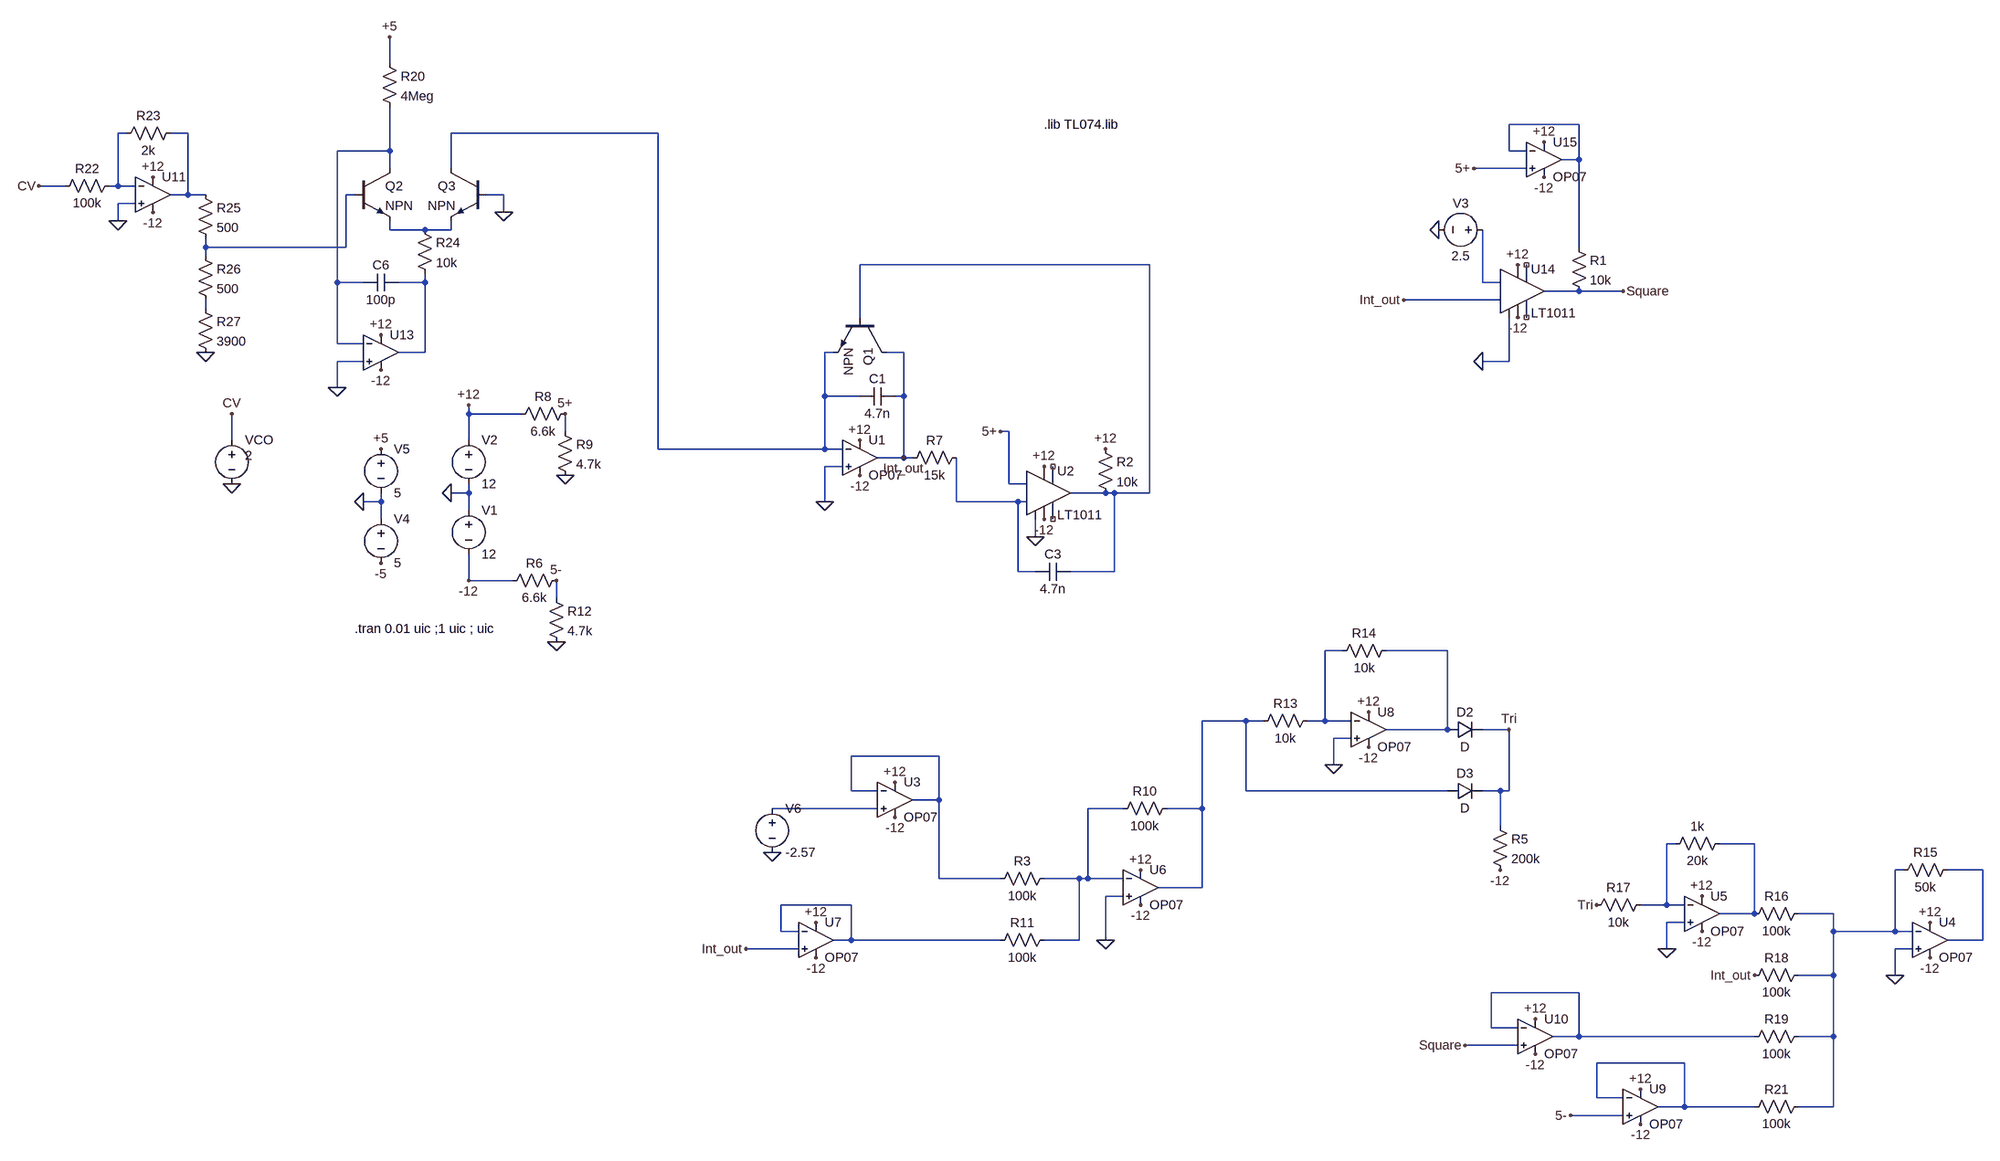
[diagram p0: schematic VCO new.asc]
VCO new.asc, the LTspice schematic file:
Version 4.1
SHEET 1 2884 1308
WIRE -816 -736 -816 -784
WIRE 1392 -624 1264 -624
WIRE -1296 -608 -1312 -608
WIRE -1184 -608 -1216 -608
WIRE -288 -608 -704 -608
WIRE -816 -576 -816 -656
WIRE -816 -576 -912 -576
WIRE 1264 -576 1264 -624
WIRE 1296 -576 1264 -576
WIRE 1392 -560 1392 -624
WIRE 1392 -560 1360 -560
WIRE -816 -544 -816 -576
WIRE -704 -544 -704 -608
WIRE 1296 -544 1200 -544
WIRE -1408 -512 -1456 -512
WIRE -1312 -512 -1312 -608
WIRE -1312 -512 -1328 -512
WIRE -1280 -512 -1312 -512
WIRE -1184 -496 -1184 -608
WIRE -1184 -496 -1216 -496
WIRE -1152 -496 -1184 -496
WIRE -880 -496 -896 -496
WIRE -608 -496 -640 -496
WIRE -1280 -480 -1312 -480
WIRE -608 -464 -608 -496
WIRE -1312 -448 -1312 -480
WIRE -816 -432 -816 -448
WIRE -752 -432 -816 -432
WIRE -704 -432 -704 -448
WIRE -704 -432 -752 -432
WIRE -1152 -400 -1152 -416
WIRE -896 -400 -896 -496
WIRE -896 -400 -1152 -400
WIRE 1392 -400 1392 -560
WIRE -1152 -384 -1152 -400
WIRE 608 -368 80 -368
WIRE -912 -336 -912 -576
WIRE -864 -336 -912 -336
WIRE -752 -336 -752 -352
WIRE -752 -336 -800 -336
WIRE 1216 -336 1216 -432
WIRE 1248 -336 1216 -336
WIRE 1392 -320 1328 -320
WIRE 1472 -320 1392 -320
WIRE 1248 -304 1072 -304
WIRE -1152 -288 -1152 -304
WIRE 80 -272 80 -368
WIRE -912 -224 -912 -336
WIRE -864 -224 -912 -224
WIRE -752 -208 -752 -336
WIRE -752 -208 -800 -208
WIRE 32 -208 16 -208
WIRE 160 -208 128 -208
WIRE -864 -192 -912 -192
WIRE 1264 -192 1264 -272
WIRE 1264 -192 1216 -192
WIRE -912 -144 -912 -192
WIRE 16 -128 16 -208
WIRE 80 -128 16 -128
WIRE 160 -128 160 -208
WIRE 160 -128 144 -128
WIRE -672 -96 -672 -112
WIRE -576 -96 -672 -96
WIRE -496 -64 -496 -96
WIRE 352 -64 336 -64
WIRE -1104 -48 -1104 -96
WIRE -672 -48 -672 -96
WIRE -288 -32 -288 -608
WIRE 16 -32 16 -128
WIRE 16 -32 -288 -32
WIRE 48 -32 16 -32
WIRE 160 -16 160 -128
WIRE 160 -16 112 -16
WIRE 176 -16 160 -16
WIRE 48 0 16 0
WIRE 352 32 352 -64
WIRE 384 32 352 32
WIRE -672 48 -672 32
WIRE -672 48 -704 48
WIRE 528 48 464 48
WIRE 544 48 528 48
WIRE 608 48 608 -368
WIRE 608 48 544 48
WIRE -832 64 -832 48
WIRE -832 64 -864 64
WIRE 16 64 16 0
WIRE 256 64 256 -16
WIRE 368 64 256 64
WIRE 384 64 368 64
WIRE -672 80 -672 48
WIRE -832 96 -832 64
WIRE 400 128 400 96
WIRE 368 192 368 64
WIRE 400 192 368 192
WIRE 544 192 544 48
WIRE 544 192 464 192
WIRE -672 208 -672 160
WIRE -592 208 -672 208
WIRE -512 240 -512 208
WIRE 960 336 928 336
WIRE 1152 336 1040 336
WIRE 784 464 704 464
WIRE 816 464 784 464
WIRE 928 464 928 336
WIRE 928 464 896 464
WIRE 976 464 928 464
WIRE 1152 480 1152 336
WIRE 1152 480 1040 480
WIRE 1264 480 1216 480
WIRE 976 496 944 496
WIRE 224 528 64 528
WIRE 944 544 944 496
WIRE 64 592 64 528
WIRE 112 592 64 592
WIRE 784 592 784 464
WIRE 1152 592 784 592
WIRE 1248 592 1216 592
WIRE 1264 592 1264 480
WIRE 1264 592 1248 592
WIRE 224 608 224 528
WIRE 224 608 176 608
WIRE 112 624 -80 624
WIRE 560 624 496 624
WIRE 704 624 704 464
WIRE 704 624 640 624
WIRE 1248 656 1248 592
WIRE 1568 688 1552 688
WIRE 1712 688 1648 688
WIRE 1984 736 1968 736
WIRE 2128 736 2064 736
WIRE 224 752 224 608
WIRE 336 752 224 752
WIRE 480 752 416 752
WIRE 496 752 496 624
WIRE 496 752 480 752
WIRE 560 752 496 752
WIRE 704 768 704 624
WIRE 704 768 624 768
WIRE 560 784 528 784
WIRE 64 800 -64 800
WIRE 1552 800 1552 688
WIRE 1552 800 1504 800
WIRE 1584 800 1552 800
WIRE 1712 816 1712 688
WIRE 1712 816 1648 816
WIRE 1856 816 1792 816
WIRE 1584 832 1552 832
WIRE -64 848 -64 800
WIRE -32 848 -64 848
WIRE 1856 848 1856 816
WIRE 1968 848 1968 736
WIRE 1968 848 1856 848
WIRE 2000 848 1968 848
WIRE 64 864 64 800
WIRE 64 864 32 864
WIRE 336 864 64 864
WIRE 480 864 480 752
WIRE 480 864 416 864
WIRE 528 864 528 784
WIRE 2128 864 2128 736
WIRE 2128 864 2064 864
WIRE -32 880 -128 880
WIRE 1552 880 1552 832
WIRE 2000 880 1968 880
WIRE 1856 928 1856 848
WIRE 1856 928 1792 928
WIRE 1968 928 1968 880
WIRE 1392 960 1232 960
WIRE 1232 1024 1232 960
WIRE 1280 1024 1232 1024
WIRE 1392 1040 1392 960
WIRE 1392 1040 1344 1040
WIRE 1712 1040 1392 1040
WIRE 1856 1040 1856 928
WIRE 1856 1040 1792 1040
WIRE 1280 1056 1184 1056
WIRE 1584 1088 1424 1088
WIRE 1424 1152 1424 1088
WIRE 1472 1152 1424 1152
WIRE 1584 1168 1584 1088
WIRE 1584 1168 1536 1168
WIRE 1712 1168 1584 1168
WIRE 1856 1168 1856 1040
WIRE 1856 1168 1792 1168
WIRE 1472 1184 1376 1184
FLAG -704 48 0
FLAG -672 208 -12
FLAG 416 96 -12
FLAG 416 0 +12
FLAG 400 128 0
FLAG -864 64 0
FLAG -832 -32 +5
FLAG -832 176 -5
FLAG 528 -32 +12
FLAG 16 64 0
FLAG 80 -48 +12
FLAG 80 16 -12
FLAG 160 -16 Int_out
FLAG -672 -112 +12
FLAG -496 16 0
FLAG -496 -96 5+
FLAG 336 -64 5+
FLAG -512 320 0
FLAG -512 208 5-
FLAG 1008 448 +12
FLAG 1008 512 -12
FLAG 944 544 0
FLAG -608 -464 0
FLAG -1248 -528 +12
FLAG -1248 -464 -12
FLAG -1312 -448 0
FLAG -1104 32 0
FLAG -1104 -96 CV
FLAG -1456 -512 CV
FLAG -1152 -208 0
FLAG -832 -240 +12
FLAG -832 -176 -12
FLAG -912 -144 0
FLAG -816 -784 +5
FLAG 1280 -272 -12
FLAG 1280 -368 +12
FLAG 1472 -320 Square
FLAG 1216 -192 0
FLAG 1200 -544 5+
FLAG 1328 -592 +12
FLAG 1328 -528 -12
FLAG 1136 -432 0
FLAG 144 640 -12
FLAG 144 576 +12
FLAG 592 736 +12
FLAG 592 800 -12
FLAG 0 832 +12
FLAG 0 896 -12
FLAG -128 880 Int_out
FLAG 528 864 0
FLAG -80 704 0
FLAG 1072 -304 Int_out
FLAG 1248 736 -12
FLAG 1264 480 Tri
FLAG 2032 832 +12
FLAG 2032 896 -12
FLAG 1968 928 0
FLAG 1424 800 Tri
FLAG 1616 784 +12
FLAG 1616 848 -12
FLAG 1552 880 0
FLAG 1712 928 Int_out
FLAG 1504 1200 -12
FLAG 1504 1136 +12
FLAG 1376 1184 5-
FLAG 1312 1072 -12
FLAG 1312 1008 +12
FLAG 1184 1056 Square
SYMBOL voltage -672 64 R0
WINDOW 123 0 0 Left 0
WINDOW 39 0 0 Left 0
SYMATTR InstName V1
SYMATTR Value 12
SYMBOL voltage -672 -64 R0
WINDOW 123 0 0 Left 0
WINDOW 39 0 0 Left 0
SYMATTR InstName V2
SYMATTR Value 12
SYMBOL Comparators\\LT1011 416 48 R0
SYMATTR InstName U2
SYMBOL voltage -832 80 R0
WINDOW 123 0 0 Left 0
WINDOW 39 0 0 Left 0
SYMATTR InstName V4
SYMATTR Value 5
SYMBOL voltage -832 -48 R0
WINDOW 123 0 0 Left 0
WINDOW 39 0 0 Left 0
SYMATTR InstName V5
SYMATTR Value 5
SYMBOL res 512 -48 R0
SYMATTR InstName R2
SYMATTR Value 10k
SYMBOL OpAmps\\OP07 80 -80 R0
SYMATTR InstName U1
SYMBOL cap 144 -144 R90
WINDOW 0 0 32 VBottom 2
WINDOW 3 32 32 VTop 2
SYMATTR InstName C1
SYMATTR Value 4.7n
SYMBOL npn 128 -272 R90
SYMATTR InstName Q1
SYMBOL res -592 -80 R270
WINDOW 0 32 56 VTop 2
WINDOW 3 0 56 VBottom 2
SYMATTR InstName R8
SYMATTR Value 6.6k
SYMBOL res -512 -80 R0
SYMATTR InstName R9
SYMATTR Value 4.7k
SYMBOL res -608 224 R270
WINDOW 0 32 56 VTop 2
WINDOW 3 0 56 VBottom 2
SYMATTR InstName R6
SYMATTR Value 6.6k
SYMBOL res -528 224 R0
SYMATTR InstName R12
SYMATTR Value 4.7k
SYMBOL OpAmps\\OP07 1008 416 R0
SYMATTR InstName U8
SYMBOL res 912 448 R90
WINDOW 0 0 56 VBottom 2
WINDOW 3 32 56 VTop 2
SYMATTR InstName R13
SYMATTR Value 10k
SYMBOL res 1056 320 R90
WINDOW 0 0 56 VBottom 2
WINDOW 3 32 56 VTop 2
SYMATTR InstName R14
SYMATTR Value 10k
SYMBOL diode 1152 496 R270
WINDOW 0 32 32 VTop 2
WINDOW 3 0 32 VBottom 2
SYMATTR InstName D2
SYMBOL diode 1152 608 R270
WINDOW 0 32 32 VTop 2
WINDOW 3 0 32 VBottom 2
SYMATTR InstName D3
SYMBOL npn -880 -544 R0
SYMATTR InstName Q2
SYMBOL npn -640 -544 M0
SYMATTR InstName Q3
SYMBOL OpAmps\\UniversalOpAmp -1248 -496 R0
SYMATTR InstName U11
SYMBOL res -1312 -528 R90
WINDOW 0 0 56 VBottom 2
WINDOW 3 32 56 VTop 2
SYMATTR InstName R22
SYMATTR Value 100k
SYMBOL voltage -1104 -64 R0
WINDOW 123 0 0 Left 0
WINDOW 39 0 0 Left 0
WINDOW 3 24 44 Left 2
SYMATTR Value 2
SYMATTR InstName VCO
SYMBOL res -1200 -624 R90
WINDOW 0 0 56 VBottom 2
WINDOW 3 32 56 VTop 2
SYMATTR InstName R23
SYMATTR Value 2k
SYMBOL res -768 -448 R0
SYMATTR InstName R24
SYMATTR Value 10k
SYMBOL res -1168 -512 R0
SYMATTR InstName R25
SYMATTR Value 500
SYMBOL res -1168 -400 R0
SYMATTR InstName R26
SYMATTR Value 500
SYMBOL res -1168 -304 R0
SYMATTR InstName R27
SYMATTR Value 3900
SYMBOL OpAmps\\UniversalOpAmp -832 -208 R0
SYMATTR InstName U13
SYMBOL cap -800 -352 R90
WINDOW 0 0 32 VBottom 2
WINDOW 3 32 32 VTop 2
SYMATTR InstName C6
SYMATTR Value 100p
SYMBOL res -832 -752 R0
SYMATTR InstName R20
SYMATTR Value 4Meg
SYMBOL Comparators\\LT1011 1280 -320 R0
SYMATTR InstName U14
SYMBOL res 1376 -416 R0
SYMATTR InstName R1
SYMATTR Value 10k
SYMBOL OpAmps\\OP07 1328 -624 R0
SYMATTR InstName U15
SYMBOL voltage 1232 -432 R90
WINDOW 0 -32 56 VBottom 2
WINDOW 3 32 56 VTop 2
WINDOW 123 0 0 Left 0
WINDOW 39 0 0 Left 0
SYMATTR InstName V3
SYMATTR Value 2.5
SYMBOL OpAmps\\OP07 144 544 R0
SYMATTR InstName U3
SYMBOL OpAmps\\OP07 592 704 R0
SYMATTR InstName U6
SYMBOL res 432 736 R90
WINDOW 0 0 56 VBottom 2
WINDOW 3 32 56 VTop 2
SYMATTR InstName R3
SYMATTR Value 100k
SYMBOL res 656 608 R90
WINDOW 0 0 56 VBottom 2
WINDOW 3 32 56 VTop 2
SYMATTR InstName R10
SYMATTR Value 100k
SYMBOL OpAmps\\OP07 0 800 R0
SYMATTR InstName U7
SYMBOL res 432 848 R90
WINDOW 0 0 56 VBottom 2
WINDOW 3 32 56 VTop 2
SYMATTR InstName R11
SYMATTR Value 100k
SYMBOL voltage -80 608 R0
WINDOW 123 0 0 Left 0
WINDOW 39 0 0 Left 0
SYMATTR InstName V6
SYMATTR Value -2.57
SYMBOL res 1232 640 R0
SYMATTR InstName R5
SYMATTR Value 200k
SYMBOL res 272 -32 R90
WINDOW 0 0 56 VBottom 2
WINDOW 3 32 56 VTop 2
SYMATTR InstName R7
SYMATTR Value 15k
SYMBOL cap 464 176 R90
WINDOW 0 0 32 VBottom 2
WINDOW 3 32 32 VTop 2
SYMATTR InstName C3
SYMATTR Value 4.7n
SYMBOL OpAmps\\OP07 2032 800 R0
SYMATTR InstName U4
SYMBOL res 2080 720 R90
WINDOW 0 0 56 VBottom 2
WINDOW 3 32 56 VTop 2
SYMATTR InstName R15
SYMATTR Value 50k
SYMBOL OpAmps\\OP07 1616 752 R0
SYMATTR InstName U5
SYMBOL res 1664 672 R90
WINDOW 0 0 56 VBottom 2
WINDOW 3 32 56 VTop 2
SYMATTR InstName 1k
SYMATTR Value 20k
SYMBOL res 1520 784 R90
WINDOW 0 0 56 VBottom 2
WINDOW 3 32 56 VTop 2
SYMATTR InstName R17
SYMATTR Value 10k
SYMBOL res 1808 800 R90
WINDOW 0 0 56 VBottom 2
WINDOW 3 32 56 VTop 2
SYMATTR InstName R16
SYMATTR Value 100k
SYMBOL res 1808 912 R90
WINDOW 0 0 56 VBottom 2
WINDOW 3 32 56 VTop 2
SYMATTR InstName R18
SYMATTR Value 100k
SYMBOL res 1808 1024 R90
WINDOW 0 0 56 VBottom 2
WINDOW 3 32 56 VTop 2
SYMATTR InstName R19
SYMATTR Value 100k
SYMBOL res 1808 1152 R90
WINDOW 0 0 56 VBottom 2
WINDOW 3 32 56 VTop 2
SYMATTR InstName R21
SYMATTR Value 100k
SYMBOL OpAmps\\OP07 1504 1104 R0
SYMATTR InstName U9
SYMBOL OpAmps\\OP07 1312 976 R0
SYMATTR InstName U10
TEXT -880 296 Left 2 !.tran 0.01 uic ;1 uic ; uic
TEXT 416 -624 Left 2 !.lib TL074.lib

The netlist it stands for:
* VCO new.asc
V1 0 -12 12
V2 +12 0 12
X§U2 0 N012 5+ -12 NC_01 NC_02 N008 +12 LT1011
V4 0 -5 5
V5 +5 0 5
R2 +12 N008 10k
X§U1 0 N004 +12 -12 Int_out LT1001  ; OP07, pins In+ In- V+ V- OUT
C1 Int_out N004 4.7n
Q1 Int_out N008 N004 0 NPN
R8 +12 5+ 6.6k
R9 5+ 0 4.7k
R6 -12 5- 6.6k
R12 5- 0 4.7k
X§U8 0 N013 +12 -12 N014 LT1001  ; OP07, pins In+ In- V+ V- OUT
R13 N013 N015 10k
R14 N014 N013 10k
D2 N014 Tri D
D3 N015 Tri D
Q2 N005 N006 N007 0 NPN
Q3 N004 0 N007 0 NPN
X§U11 0 N002 +12 -12 N003 level1 Avol=1Meg GBW=10Meg Vos=0 En=0 Enk=0 In=0 Ink=0 Rin=500Meg  ; pins In+ In- V+ V- OUT
R22 N002 CV 100k
VCO CV 0 2
R23 N003 N002 2k
R24 N007 N009 10k
R25 N003 N006 500
R26 N006 N011 500
R27 N011 0 3900
X§U13 0 N005 +12 -12 N009 level1 Avol=1Meg GBW=10Meg Vos=0 En=0 Enk=0 In=0 Ink=0 Rin=500Meg  ; pins In+ In- V+ V- OUT
C6 N009 N005 100p
R20 +5 N005 4Meg
X§U14 0 Int_out N010 -12 NC_03 NC_04 Square +12 LT1011
R1 N001 Square 10k
X§U15 5+ N001 +12 -12 N001 LT1001  ; OP07, pins In+ In- V+ V- OUT
V3 N010 0 2.5
X§U3 N017 N016 +12 -12 N016 LT1001  ; OP07, pins In+ In- V+ V- OUT
X§U6 0 N018 +12 -12 N015 LT1001  ; OP07, pins In+ In- V+ V- OUT
R3 N018 N016 100k
R10 N015 N018 100k
X§U7 Int_out N023 +12 -12 N023 LT1001  ; OP07, pins In+ In- V+ V- OUT
R11 N018 N023 100k
V6 N017 0 -2.57
R5 Tri -12 200k
R7 N012 Int_out 15k
C3 N008 N012 4.7n
X§U4 0 N021 +12 -12 N022 LT1001  ; OP07, pins In+ In- V+ V- OUT
R15 N022 N021 50k
X§U5 0 N019 +12 -12 N020 LT1001  ; OP07, pins In+ In- V+ V- OUT
R§1k N020 N019 20k
R17 N019 Tri 10k
R16 N021 N020 100k
R18 N021 Int_out 100k
R19 N021 N024 100k
R21 N021 N025 100k
X§U9 5- N025 +12 -12 N025 LT1001  ; OP07, pins In+ In- V+ V- OUT
X§U10 Square N024 +12 -12 N024 LT1001  ; OP07, pins In+ In- V+ V- OUT
.model D D
.lib standard.dio
.model NPN NPN
.model PNP PNP
.lib standard.bjt
.tran 0.01 uic ;1 uic ; uic
.lib TL074.lib
.lib LTC1.lib
.lib LTC.lib
.lib UniversalOpAmp1.lib
.backanno
.end